# EasyEDA schematic P02_MCU_USB.json
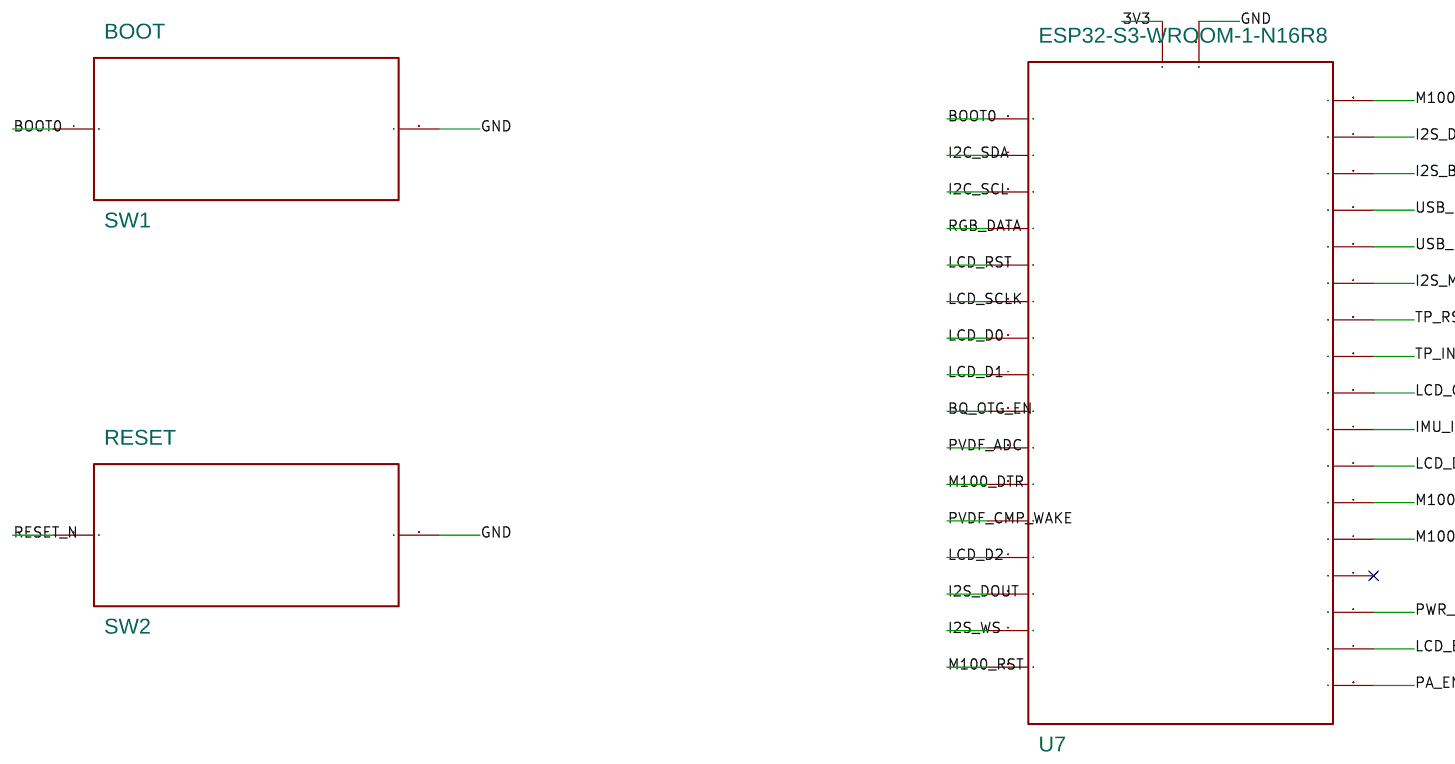
[diagram p0: schematic sheet]

## Parts
SW1  BOOT  [TACT-SW]
SW2  RESET  [TACT-SW]
U7  ESP32-S3-WROOM-1-N16R8  [MODULE-41P]

## Library data of the parts
SW1 SW2 = Switch
U7 = ESP32_S3_WROOM

## Nets
3V3: U7.49(1)
GND: SW1.2(1) SW2.2(1) U7.50(1)
BOOT0: SW1.1 U7.0(1)
BQ_OTG_EN: U7.8(1)
I2C_SCL: U7.2(1)
I2C_SDA: U7.1
I2S_BCLK: U7.18(1)
I2S_DIN: U7.17(1)
I2S_DOUT: U7.13(1)
I2S_MCLK: U7.21(1)
I2S_WS: U7.14(1)
IMU_INT1: U7.41(1)
LCD_CS: U7.40(1)
LCD_D0: U7.6(1)
LCD_D1: U7.7(1)
LCD_D2: U7.12(1)
LCD_D3: U7.42(1)
LCD_EN: U7.47(1)
LCD_RST: U7.4(1)
LCD_SCLK: U7.5(1)
M100_DTR: U7.10(1)
M100_NET_STATUS_COMPAT: U7.16(1)
M100_RST: U7.15(1)
M100_RXD: U7.44(1)
M100_TXD: U7.43(1)
PA_EN: U7.48(1)
PVDF_ADC: U7.9(1)
PVDF_CMP_WAKE: U7.11(1)
PWR_STATE: U7.46(1)
RESET_N: SW2.1
RGB_DATA: U7.3(1)
TP_INT: U7.39(1)
TP_RST: U7.38(1)
USB_D+: U7.20(1)
USB_D-: U7.19(1)

Not connected (* = marked no-connect by the designer): U7 45(1)*

## Notes on the sheet
- P02  ESP32-S3 主控、启动/复位与 USB-Serial-JTAG
- GPIO 合同来自 ARCHITECTURE-SPINE；IO8= BQ_OTG_EN，IO16=兼容逻辑 NC。
- 主控模块保留 PCB 天线、16MB Flash/8MB PSRAM；电源去耦按模块手册补齐。
- GPIO0/46 为启动绑带；IO35–37、IO45、IO22–34 不使用
- USB-Serial-JTAG：IO19=D−，IO20=D+；不启用 USB-OTG
